# Altium schematic sheet Sensor_Schem.SchDoc
size A3; SheetNumber: 1; SheetTotal: 1
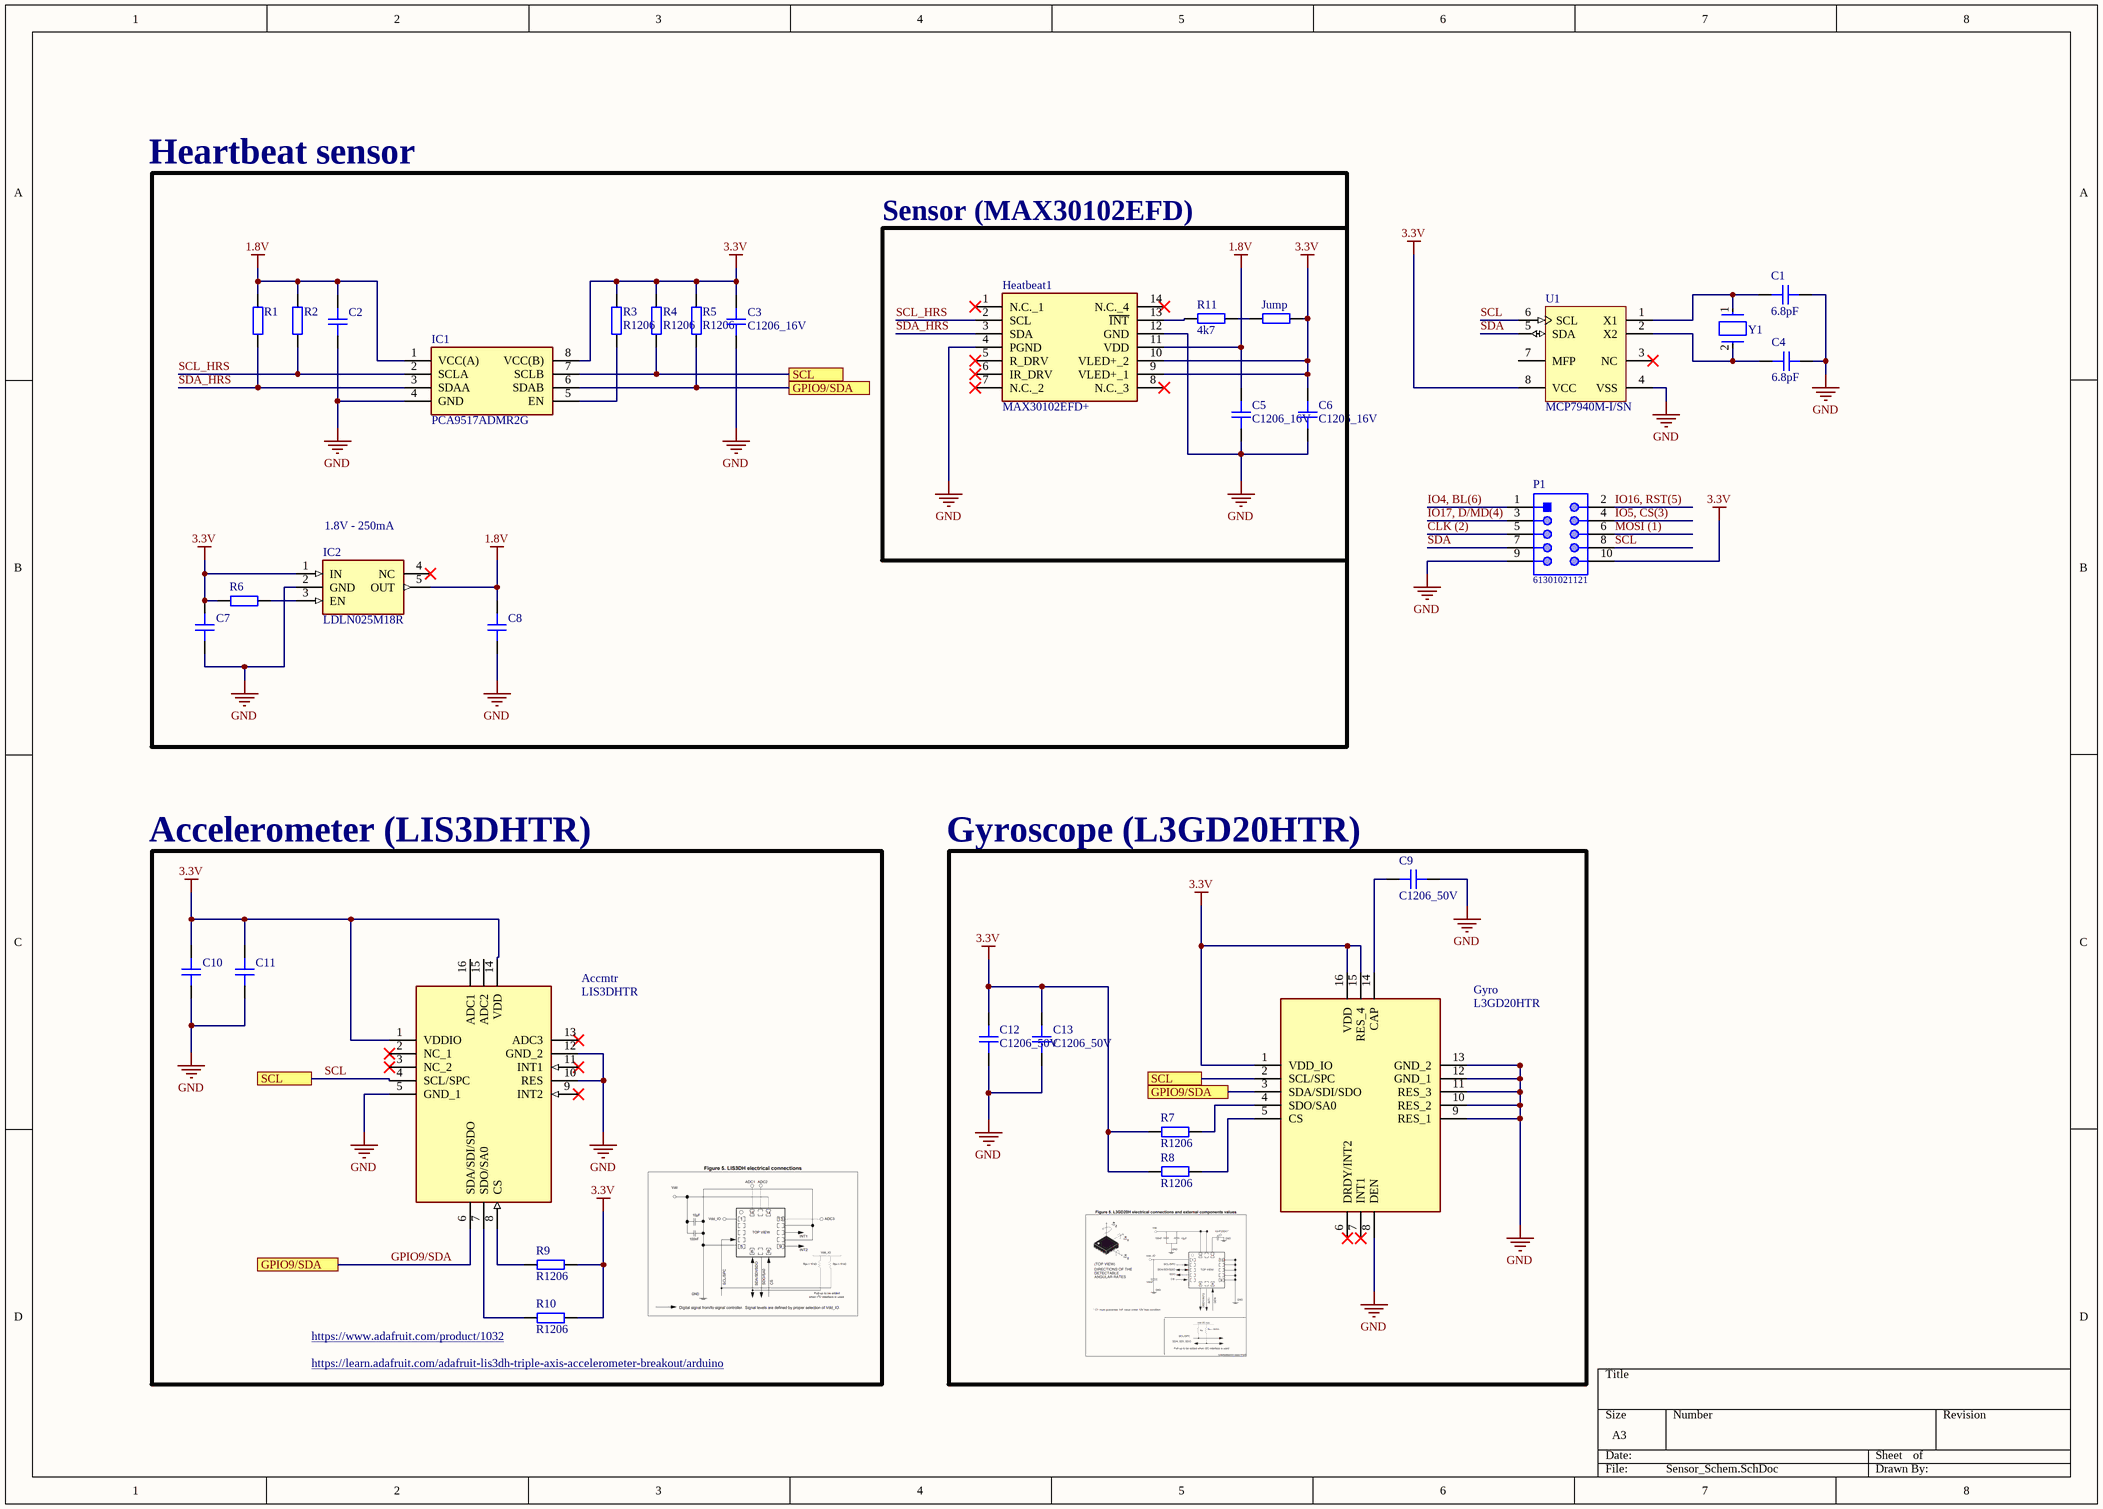
[diagram p0: Sensor_Schem.SchDoc]

## Parts
Accmtr  LIS3DHTR  [LIS3DHTR]
C1  6.8pF  [CAP_1206]
C2  C1206_16V  [CAP_1206]  (value not drawn)
C3  C1206_16V  [CAP_1206]
C4  6.8pF  [CAP_1206]
C5  C1206_16V  [CAP_1206]
C6  C1206_16V  [CAP_1206]
C7  C1206_16V  [CAP_1206]  (value not drawn)
C8  C1206_16V  [CAP_1206]  (value not drawn)
C9  C1206_50V  [CAP_1206]
C10  C1206_50V  [CAP_1206]  (value not drawn)
C11  C1206_50V  [CAP_1206]  (value not drawn)
C12  C1206_50V  [CAP_1206]
C13  C1206_50V  [CAP_1206]
Gyro  L3GD20HTR  [H3LIS100DLTR]
Heatbeat1  MAX30102EFD+  [14-LEAD-OESIP]
IC1  PCA9517ADMR2G  [SOP65P490X110-8N]
IC2  LDLN025M18R  [SOT95P280X145-5N]
Jump  R0402  [RES_0402]  (value not drawn)
P1  61301021121  [61301021121]
R1  R1206  [RES_1206]  (value not drawn)
R2  R1206  [RES_1206]  (value not drawn)
R3  R1206  [RES_1206]
R4  R1206  [RES_1206]
R5  R1206  [RES_1206]
R6  R1206  [RES_1206]  (value not drawn)
R7  R1206  [RES_1206]
R8  R1206  [RES_1206]
R9  R1206  [RES_1206]
R10  R1206  [RES_1206]
R11  4k7  [RES_1206]
U1  MCP7940M-I/SN  [MCHP-SOIC-SN8_L]
Y1  ABS07-120-32.768KHZ-T  [FP-ABS07-120-MFG]  (value not drawn)

## Blocks framed on the sheet
Heartbeat sensor: C2 C3 C7 C8 IC1 IC2 R1-R6
Sensor (MAX30102EFD): C5 C6 Heatbeat1 Jump R11
Accelerometer (LIS3DHTR): Accmtr C10 C11 R9 R10
Gyroscope (L3GD20HTR): C9 C12 C13 Gyro R7 R8

## Ports
GPIO9/SDA (see Sensor_Schem[1D], Sensor_Schem[3B]), GPIO9/SDA (see Sensor_Schem[1D], Sensor_Schem[5C]), GPIO9/SDA (see Sensor_Schem[3B], Sensor_Schem[5C]), SCL (see Sensor_Schem[1C], Sensor_Schem[3A]), SCL (see Sensor_Schem[1C], Sensor_Schem[5C]), SCL (see Sensor_Schem[3A], Sensor_Schem[5C])

## Nets
1.8V: C2.2 C5.2 C8.2 Heatbeat1.11(VDD) IC1.1(VCC(A)) IC2.5(OUT) R1.1 R2.1
3.3V: Accmtr.1(VDDIO) Accmtr.14(VDD) C3.2 C6.2 C7.2 C10.2 C11.2 C12.2 C13.2 Gyro.1(VDD_IO) Gyro.15(RES_4) Gyro.16(VDD) Heatbeat1.9(VLED+_1) Heatbeat1.10(VLED+_2) IC1.8(VCC(B)) IC2.1(IN) Jump.2 P1.10 R3.1 R4.1 R5.1 R6.1 R7.2 R8.2 R9.1 R10.1 U1.8(VCC)
GND: Accmtr.5(GND_1) Accmtr.10(RES) Accmtr.12(GND_2) C1.2 C2.1 C3.1 C4.2 C5.1 C6.1 C7.1 C8.1 C9.2 C10.1 C11.1 C12.1 C13.1 Gyro.8(DEN) Gyro.9(RES_1) Gyro.10(RES_2) Gyro.11(RES_3) Gyro.12(GND_1) Gyro.13(GND_2) Heatbeat1.4(PGND) Heatbeat1.12(GND) IC1.4(GND) IC2.2(GND) P1.9 U1.4(VSS)
CLK (2): P1.5
GPIO9/SDA: Accmtr.6(SDA/SDI/SDO) Gyro.3(SDA/SDI/SDO) IC1.6(SDAB) R5.2 ; port GPIO9/SDA
IO4, BL(6): P1.1
IO5, CS(3): P1.4
IO16, RST(5): P1.2
IO17, D/MD(4): P1.3
MOSI (1): P1.6
SCL: Accmtr.4(SCL/SPC) Gyro.2(SCL/SPC) IC1.7(SCLB) P1.8 R4.2 U1.6(SCL) ; port SCL
SCL_HRS: Heatbeat1.2(SCL) IC1.2(SCLA) R2.2
SDA: P1.7 U1.5(SDA)
SDA_HRS: Heatbeat1.3(SDA) IC1.3(SDAA) R1.2
NetAccmtr_7: Accmtr.7(SDO/SA0) R10.2
NetAccmtr_8: Accmtr.8(CS) R9.2
NetC1_1: C1.1 U1.1(X1) Y1.1
NetC4_1: C4.1 U1.2(X2) Y1.2
NetC9_1: C9.1 Gyro.14(CAP)
NetGyro_4: Gyro.4(SDO/SA0) R7.1
NetGyro_5: Gyro.5(CS) R8.1
NetHeatbeat1_13: Heatbeat1.13(~{INT}) R11.2
NetIC1_5: IC1.5(EN) R3.2
NetIC2_3: IC2.3(EN) R6.2
NetJump_1: Jump.1 R11.1

Not connected (* = marked no-connect by the designer): Accmtr 2(NC_1)* 3(NC_2)* 9(INT2)* 11(INT1)* 13(ADC3)* 15(ADC2) 16(ADC1); Gyro 6(DRDY/INT2)* 7(INT1)*; Heatbeat1 1(N.C._1)* 5(R_DRV)* 6(IR_DRV)* 7(N.C._2)* 8(N.C._3)* 14(N.C._4)*; IC2 4(NC)*; U1 3(NC)* 7(MFP)

## Notes on the sheet
- (near IC2) 1.8V - 250mA
- (near R10) https://www.adafruit.com/product/1032
- (near R10) https://learn.adafruit.com/adafruit-lis3dh-triple-axis-accelerometer-breakout/arduino

## Library data of the parts
Accmtr = LIS3DHTR: Accelerometer; Manufacturer_Name: STMicroelectronics; Datasheet Link: http://www.st.com/content/ccc/resource/technical/document/datasheet/3c/ae/50/85/d6/b1/46/fe/CD00274221.pdf/files/CD00274221.pdf/jcr:content/translations/en.CD00274221.pdf; Height: 1mm; Manufacturer_Part_Number: LIS3DHTR; Mouser Part Number: 511-LIS3DHTR; Mouser Price/Stock: https://www.mouser.co.uk/ProductDetail/STMicroelectronics/LIS3DHTR?qs=6la6oa3D8xzhXYax3cEo4w%3D%3D; Arrow Part Number: LIS3DHTR; Arrow Price/Stock: https://www.arrow.com/en/products/lis3dhtr/stmicroelectronics
C1 C4 C9-C13 = CAP_1206_50V: Capacitor SMD 1206 50V
C2 C3 C5-C8 = CAP_1206_16V: Capacitor SMD 1206 16V
Gyro = L3GD20HTR: MEMS motion sensor: / three-axis digital output gyroscope; Manufacturer_Name: STMicroelectronics; Datasheet Link: http://www.st.com/content/ccc/resource/technical/document/datasheet/35/b1/e0/39/71/57/43/01/DM00060659.pdf/files/DM00060659.pdf/jcr:content/translations/en.DM00060659.pdf; Height: 1mm; Manufacturer_Part_Number: L3GD20HTR; Mouser Part Number: 511-L3GD20HTR; Mouser Price/Stock: https://www.mouser.co.uk/ProductDetail/STMicroelectronics/L3GD20HTR?qs=7v3IMFVTeKNoM%2F2Sb4QSlQ%3D%3D; Arrow Part Number: L3GD20HTR; Arrow Price/Stock: https://www.arrow.com/en/products/l3gd20htr/stmicroelectronics
Heatbeat1 = MAX30102EFD+: Integrated Circuit; Manufacturer_Name: Analog Devices; Datasheet Link: https://datasheets.maximintegrated.com/en/ds/MAX30102.pdf; Manufacturer_Part_Number: MAX30102EFD+; Mouser Part Number: 700-MAX30102EFD+; Mouser Price/Stock: https://www.mouser.co.uk/ProductDetail/Maxim-Integrated/MAX30102EFD%2b?qs=nVS1qgv%252BQrk9UYEvS27V%2Fg%3D%3D
IC1 = PCA9517ADMR2G: Integrated Circuit; Manufacturer_Name: onsemi; Datasheet Link: https://www.arrow.com/en/products/pca9517admr2g/on-semiconductor; Height: 1.1mm; Manufacturer_Part_Number: PCA9517ADMR2G; Mouser Part Number: 863-PCA9517ADMR2G; Mouser Price/Stock: https://www.mouser.co.uk/ProductDetail/onsemi/PCA9517ADMR2G?qs=tCMd4XlZ%2FiBws0nQ3cmpKw%3D%3D; Arrow Part Number: PCA9517ADMR2G; Arrow Price/Stock: https://www.arrow.com/en/products/pca9517admr2g/on-semiconductor?region=nac
IC2 = LDLN025M18R: Integrated Circuit; Manufacturer_Name: STMicroelectronics; Datasheet Link: https://mouser.componentsearchengine.com/Datasheets/2/LDLN025M18R.pdf; Height: 1.45mm; Manufacturer_Part_Number: LDLN025M18R; Mouser Part Number: 511-LDLN025M18R; Mouser Price/Stock: https://www.mouser.co.uk/ProductDetail/STMicroelectronics/LDLN025M18R?qs=5aG0NVq1C4xLjfzI8y7cFQ%3D%3D; Arrow Part Number: LDLN025M18R; Arrow Price/Stock: https://www.arrow.com/en/products/ldln025m18r/stmicroelectronics
Jump = RES_0402: Resistor SMD 0402
P1 = CMP-1502-01084-1: THT Vertical Pin Header WR-PHD, Pitch 2.54 mm, Dual Row, 10 pins; Manufacturer: Wurth Elektronik; Working Voltage: 250VAC; Pitch: 2.54mm; Contact Resistance: 20mOhm; Gender: Male; Rated Current: 3A; Withstanding Voltage: 500VAC; Pin Number: 10; Operating Temperature: -40to105degC; Mounting Technology: THT; Publisher: WurthElektronik; Manufacturer URL: http://www.we-online.de; Part Number: 61301021121; Row Number: Dual; Packaging: Bag; Orientation: Vertical; Package Reference: 61301021121; Datasheet URL: https://katalog.we-online.de/em/datasheet/6130xx21121.pdf
R1-R11 = RES_1206: Resistor SMD 1206
U1 = CMP-0186-00321-1: Low-Cost I2C™ Real-Time Clock / Calendar with SRAM, 400 KHz Communications Speed, 64 Bytes SRAM, -40 to 85 degC, 8-pin SOIC (SN8), Tube; Manufacturer: Microchip; Mounting Technology: Surface Mount; ComponentLink1URL: http://www.microchip.com; ComponentLink2URL: http://ww1.microchip.com/downloads/en/DeviceDoc/22292A.pdf; PackageVersion: C04-057C; ComponentLink4Description: Product URL; ComponentLink2Description: Datasheet; PackageDescription: 8-Lead Plastic Small Outline, 4.9 x 3.9 mm Body, 1.27 mm Pitch; DatasheetVersion: Rev. A; ComponentLink3URL: http://www.microchip.com/stellent/groups/techpub_sg/documents/packagingspec/en012702.pdf; PackageReference: SOIC-SN8; ComponentLink4URL: http://www.microchip.com/MCP7940M; ComponentLink3Description: Package Specification; PartNumber: MCP7940M-I/SN; ComponentLink1Description: Manufacturer URL
Y1 = CMP-2000-07587-2: CRYSTAL 32.7680KHZ 6PF SMD; Frequency Tolerance: 20ppm; Series Resistance: 60kR; ESR (Equivalent Series Resistance): 55kR; Depth: 1.5mm; Width: 0.061inch; Number of Pins: 2; Max Operating Temperature: 85°C; Length: 3.2mm; Case/Package: SMD/SMT; Series: ABS07; Lead Free: Lead Free; Min Operating Temperature: -40°C; Load Capacitance: 6pF; Packaging: Tape and Reel; Height: 0.035inch; Radiation Hardening: No; Tolerance: 20ppm; Operating Frequency: 32.768 kHz; Termination: SMD/SMT; REACH SVHC: No SVHC; RoHS Compliant: Yes; Frequency: 32.768kHz; Package Quantity: 3000; Mount: Surface Mount